# EAGLE design Otoponic (EAGLE 9.6.2)
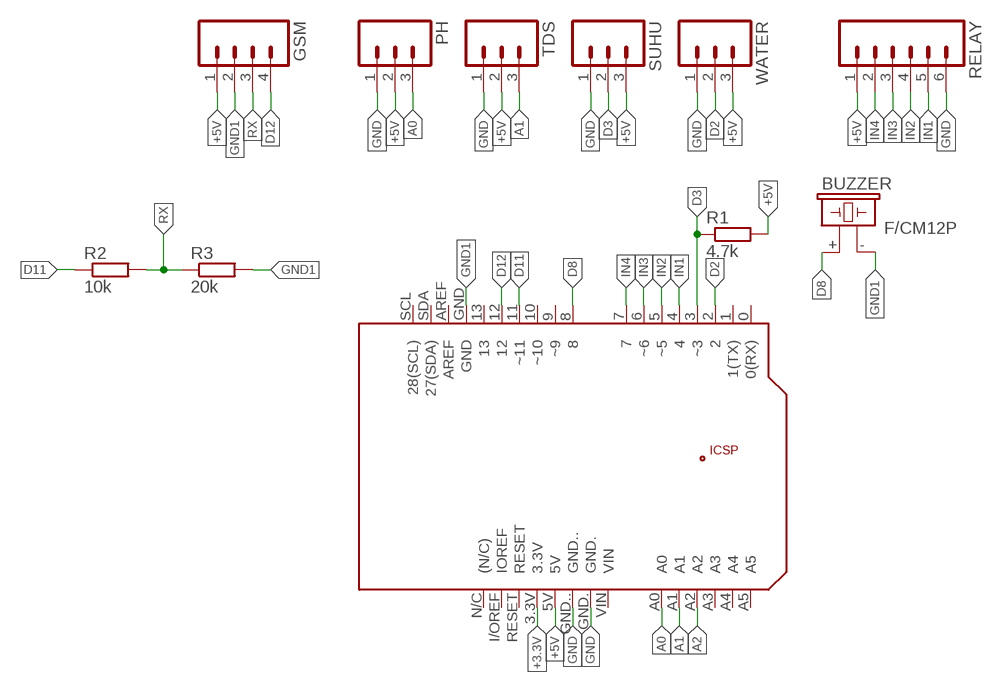
[diagram p0: schematic, sheet 1]

## Parts
BUZZER  F/CM12P  [F/CM12P]
GSM  M04  [04P]
PCB2  ARDUINO_UNO  [ARDUINO_UNO]
PH  M03  [03P]
R1  4.7k  R-EU_0207/10  [0207/10]
R2  10k  R-EU_0207/10  [0207/10]
R3  20k  R-EU_0207/10  [0207/10]
RELAY  M06  [06P]
SUHU  M03  [03P]
TDS  M03  [03P]
WATER  M03  [03P]

## Nets
+3.3V: PCB2.3.3V
+5V: GSM.1 PCB2.5V PH.2 R1.2 RELAY.1 SUHU.3 TDS.2 WATER.3
A0: PCB2.A0 PH.3
A1: PCB2.A1 TDS.3
A2: PCB2.A2
D2: PCB2.2 WATER.2
D3: PCB2.3(~3) R1.1 SUHU.2
D8: BUZZER.+ PCB2.8
D11: PCB2.11(~11) R2.1
D12: GSM.4 PCB2.12
GND: PCB2.GND. PCB2.GND.. PH.1 RELAY.6 SUHU.1 TDS.1 WATER.1
GND1: BUZZER.- GSM.2 PCB2.GND R3.2
IN1: PCB2.4 RELAY.5
IN2: PCB2.5(~5) RELAY.4
IN3: PCB2.6(~6) RELAY.3
IN4: PCB2.7 RELAY.2
RX: GSM.3 R2.2 R3.1
Unconnected: PCB2.0(0(RX)) PCB2.1(1(TX)) PCB2.9(~9) PCB2.10(~10) PCB2.13 PCB2.+5V PCB2.A3 PCB2.A4 PCB2.A5 PCB2.AREF PCB2.GND_ PCB2.I/OREF(IOREF) PCB2.MISO PCB2.MOSI PCB2.N/C((N/C)) PCB2.RESET PCB2.RESET. PCB2.SCK PCB2.SCL(28(SCL)) PCB2.SDA(27(SDA)) PCB2.VIN

## Library data of the parts
BUZZER = buzzerp:F/CM12P: BUZZER Source: Buerklin; OC_FARNELL: unknown; OC_NEWARK: unknown
GSM = con-amp-quick:M04: AMP QUICK CONNECTOR; OC_FARNELL: unknown; OC_NEWARK: unknown
PCB2 = E14_Arduino_revC:ARDUINO_UNO: Device for representing an Arduino Uno board with a footprint in an EAGLE design. Created by Dave Young for Element14. More EAGLE documentation at: http://www.element14.com/community/community/knode/cadsoft_eagle
PH SUHU TDS WATER = con-amp-quick:M03: AMP QUICK CONNECTOR; OC_FARNELL: unknown; OC_NEWARK: unknown
R1-R3 = rcl:R-EU_: RESISTOR, European symbol; SPICEPREFIX: R
RELAY = con-amp-quick:M06: AMP QUICK CONNECTOR; OC_FARNELL: unknown; OC_NEWARK: unknown

## Board
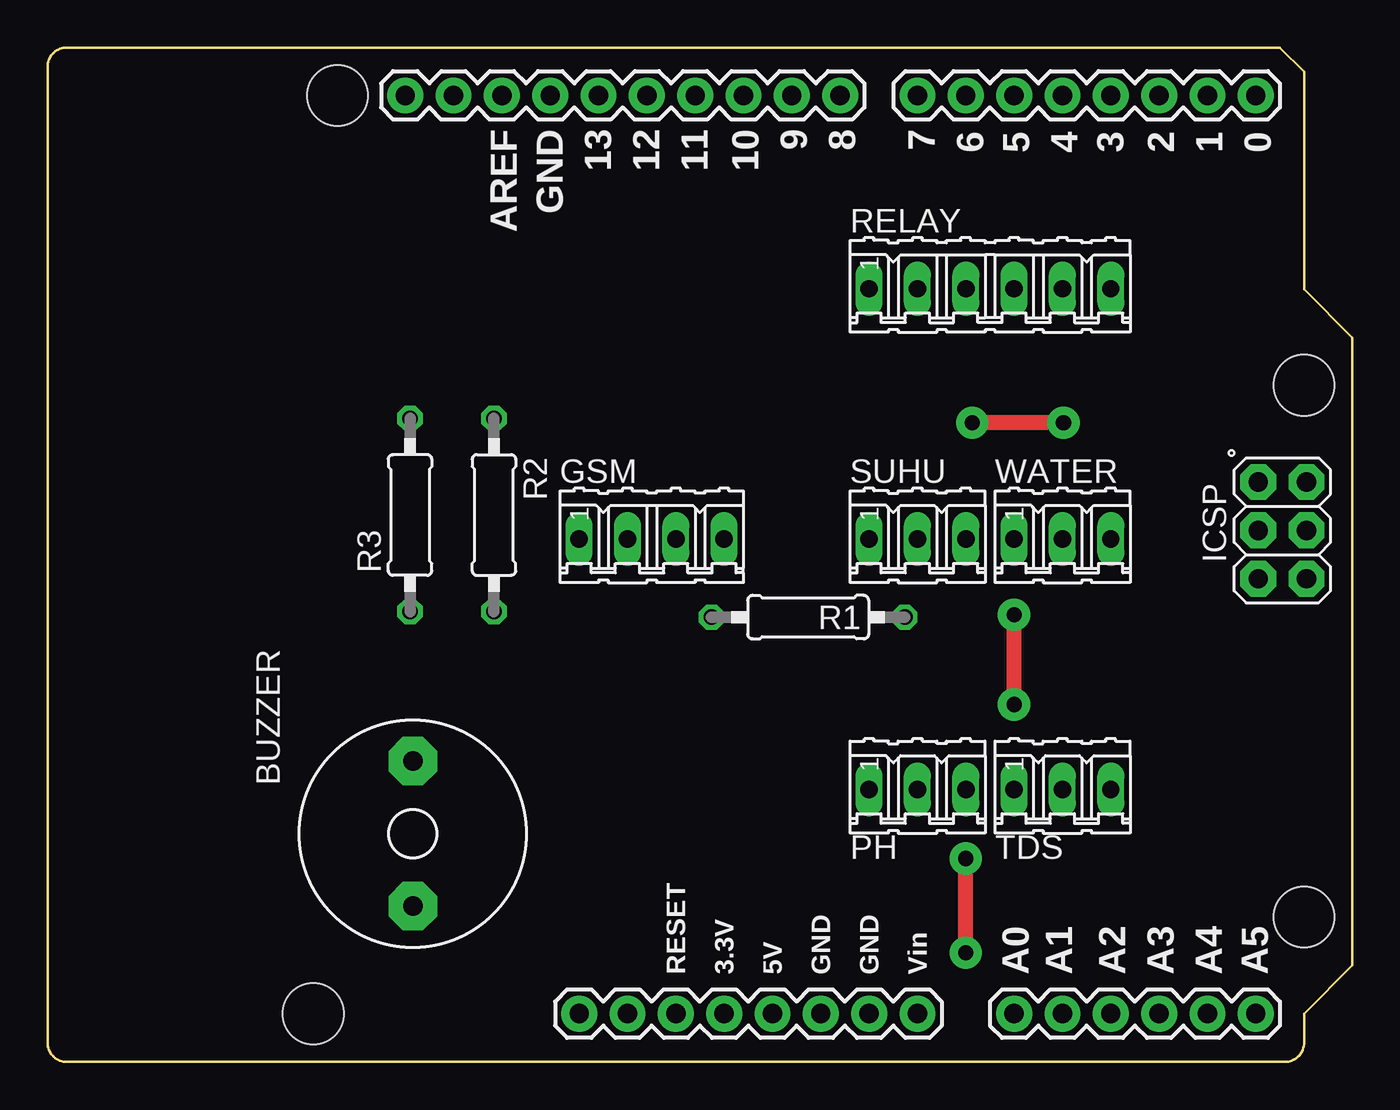
[diagram p1: board, top side]
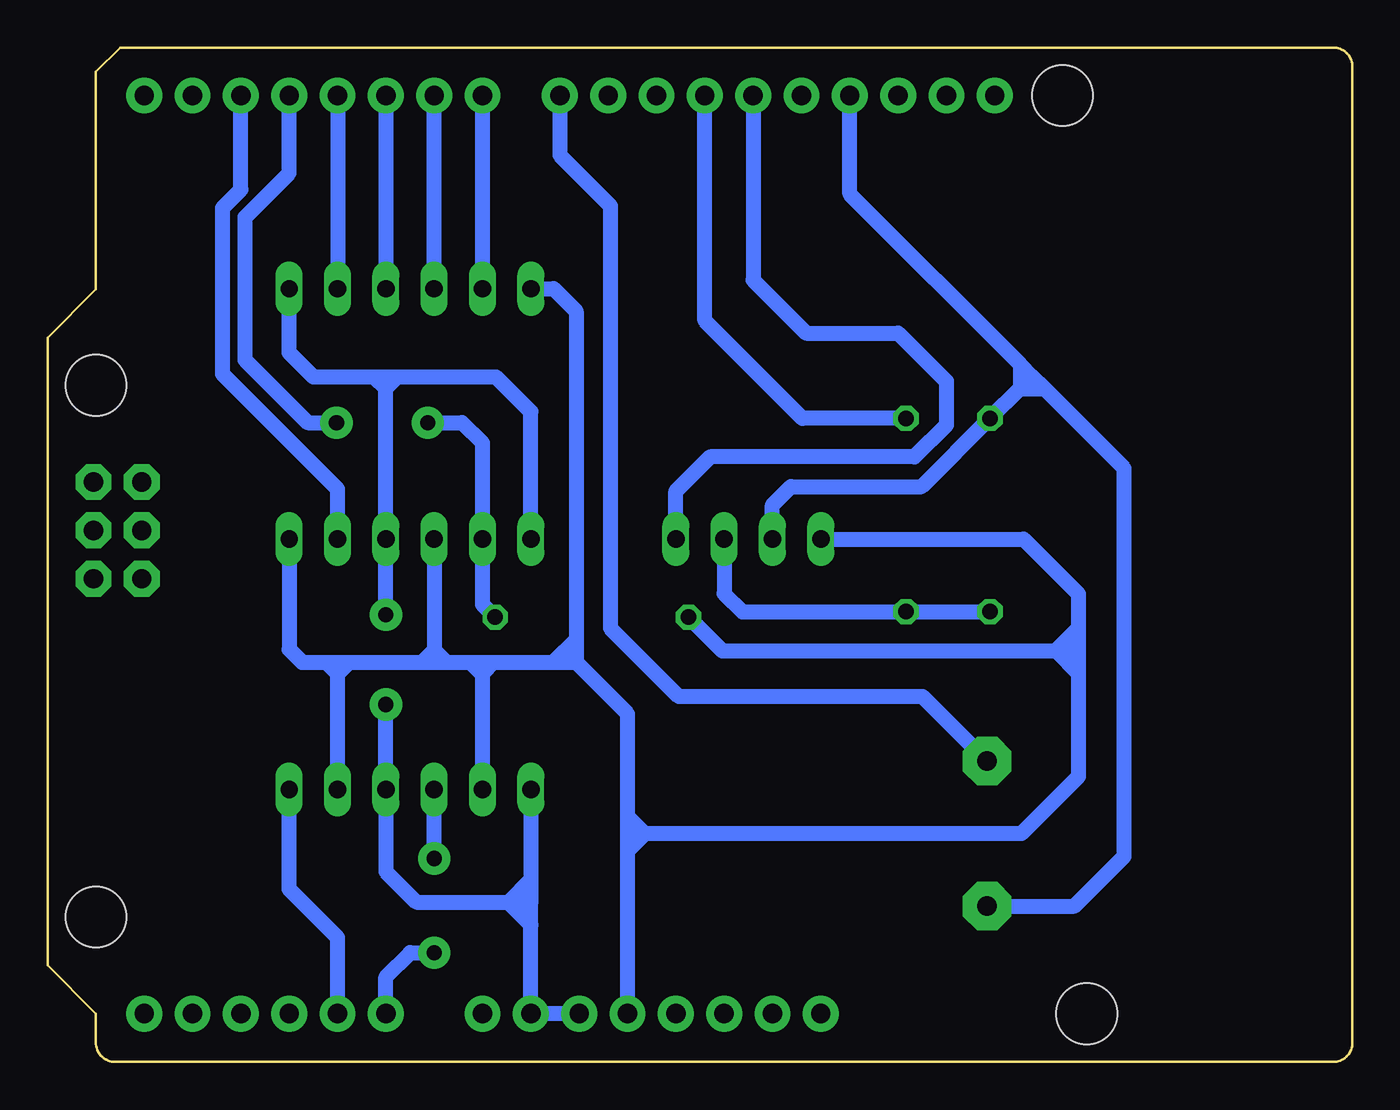
[diagram p2: board, bottom side, seen from below]

Size 68.58 x 53.31 mm. Coordinates in mm from the lower left corner, seen from the top.
Copper layers (1*16): Top 0.035mm / dielectric 1.5mm / Bottom 0.035mm
Design rules "default": minimum track width 0.8mm, minimum drill 0.8mm, track to track 15mil, track to pad 15mil, pad to pad 15mil, via to via 15mil, smd to smd 6mil, copper to edge 40mil, drill to drill 6mil, minimum pad ring 10mil, minimum via ring 8mil, stop-mask expansion 4mil, vias tented up to drill 0mil, thermal gap 10mil

### Footprints (pad centres in the part's own frame; a part is rotated, then mirrored left to right if it is on the bottom)
F/CM12P = drill 1.016 pad 2.54 octagon: + 3.81,0; - -3.81,0
04P = drill 0.914 long: 1 -3.81,0; 2 -1.27,0; 3 1.27,0; 4 3.81,0
ARDUINO_UNO = drill 1.016 pad 1.88: 0 63.5,50.8; 1 60.96,50.8; 2 58.42,50.8; 3 55.88,50.8; 3.3V 35.56,2.54; 4 53.34,50.8; 5 50.8,50.8; 5V 38.1,2.54; 6 48.26,50.8; 7 45.72,50.8; 8 41.656,50.8; 9 39.116,50.8; 10 36.576,50.8; 11 34.036,50.8; 12 31.496,50.8; 13 28.956,50.8; A0 50.8,2.54; A1 53.34,2.54; A2 55.88,2.54; A3 58.42,2.54; A4 60.96,2.54; A5 63.5,2.54; AREF 23.876,50.8; GND 26.416,50.8; GND. 43.18,2.54; GND.. 40.64,2.54; I/OREF 30.48,2.54; N/C 27.94,2.54; RESET 33.02,2.54; SCL 18.796,50.8; SDA 21.336,50.8; VIN 45.72,2.54 | drill 1.016 pad 1.88 octagon: +5V 66.167,30.48; GND_ 66.167,25.4; MISO 63.627,30.48; MOSI 66.167,27.94; RESET. 63.627,25.4; SCK 63.627,27.94 | hole 3.2: 66.04,7.62; 66.04,35.56; 15.24,50.8; 13.97,2.54
03P = drill 0.914 long: 1 -2.54,0; 2 0,0; 3 2.54,0
0207/10 = drill 0.813 octagon: 1 -5.08,0; 2 5.08,0
06P = drill 0.914 long: 1 -6.35,0; 2 -3.81,0; 3 -1.27,0; 4 1.27,0; 5 3.81,0; 6 6.35,0

### Placement (x,y rotation side)
BUZZER  19.2,12 90 top
GSM  31.75,27.48 0 top
PCB2  0,0 0 top
PH  45.72,14.32 0 top
R1  39.97,23.38 180 top
R2  23.46,28.75 270 top
R3  19.05,28.75 90 top
RELAY  49.53,40.64 0 top
SUHU  45.72,27.48 0 top
TDS  53.34,14.32 0 top
WATER  53.34,27.48 0 top

### Tracks (layer width: path | path; a pad name or v marks a point on that pad's centre or on a via)
+5V
  Bottom 0.8: RELAY.1 41.98,40.64 40.8,39.46 40.8,22.2 | 40.8,22.2 40.8,21 | GSM.1 17.28,27.48 14.4,24.6 14.4,22.8 | 14.4,22.8 14.4,21.6 | R1.2 33.12,21.6 15.6,21.6 | 14.4,21.6 15.6,21.6 | 14.4,21.6 14.4,20.4 | 14.4,20.4 14.4,15 17.4,12 37.2,12 | 15.6,21.6 14.4,20.4 | 15.6,21.6 14.4,22.8 | PCB2.5V 38.1,11.1 | 38.1,11.1 38.1,12 | 38.1,12 37.2,12 | WATER.3 55.88,21.68 55.2,21 53.94,21 | 53.94,21 53.4,21 | 53.4,21 52.8,21 | 52.8,21 48.9,21 | 48.9,21 48,21 | 48,21 47.62,21 | 47.62,21 46.35,21 | 46.35,21 45.6,21 | 45.6,21 45.12,21 | 45.12,21 42,21 | 42,21 40.8,21 | SUHU.3 48.26,21.6 | 48.26,21.6 48.26,21.26 48,21 | TDS.2 53.34,20.4 | 53.34,20.4 53.34,20.94 53.4,21 | PH.2 45.72,20.4 | 45.72,20.4 45.72,20.88 45.6,21 | 53.34,20.4 53.94,21 | 53.34,20.4 52.8,20.94 52.8,21 | 48.26,21.6 48.3,21.6 48.9,21 | 48.26,21.6 48.23,21.6 47.62,21 | 45.72,20.4 45.12,21 | 45.72,20.4 45.76,20.4 46.35,21 | 40.8,21 38.1,18.3 38.1,12.9 | 38.1,12 38.1,12.9 | 40.8,22.2 42,21 | 38.1,12.9 37.2,12 | 37.2,12 38.1,11.1
A0  (via drill 0.8 pad 1.7)
  Top 0.8: v48.26,5.74 v48.26,10.69
  Bottom 0.8: PCB2.A0 50.8,4.47 49.53,5.74 v48.26,5.74 | v48.26,10.69 PH.3
A1
  Bottom 0.8: PCB2.A1 53.34,6.54 55.88,9.08 TDS.3
D2
  Bottom 0.8: WATER.2 53.34,30.11 59.38,36.15 59.38,44.89 58.42,45.85 PCB2.2
D3  (via drill 0.8 pad 1.7)
  Top 0.8: v53.4,33.6 v48.6,33.6
  Bottom 0.8: PCB2.3 55.88,46.72 58.2,44.4 58.2,36.89 54.91,33.6 v53.4,33.6 | R1.1 45.72,24.04 SUHU.2 45.72,32.52 46.8,33.6 v48.6,33.6
D8
  Bottom 0.8: PCB2.8 41.66,47.66 39,45 39,22.8 35.4,19.2 22.59,19.2 BUZZER.+
D11
  Bottom 0.8: R2.1 28.9,33.83 34.04,38.96 PCB2.11
D12
  Bottom 0.8: GSM.4 35.56,30 33.76,31.8 23.02,31.8 21.35,33.47 21.35,35.78 23.87,38.31 28.71,38.31 31.5,41.1 PCB2.12
GND  (via drill 0.8 pad 1.7)
  Top 0.8: v50.8,18.79 v50.8,23.51
  Bottom 0.8: PCB2.GND.. PCB2.GND. 43.18,7.2 | 43.18,7.2 43.18,8.4 | PH.1 43.18,9.6 | 43.18,9.6 43.18,8.4 | SUHU.1 43.18,34.18 45,36 50.4,36 | 50.4,36 51,36 | 51,36 51.4,36 | 51.4,36 54.6,36 55.88,37.28 RELAY.6 | 44.38,8.4 49.2,8.4 50.8,10 TDS.1 v50.8,18.79 | 44.38,8.4 43.18,8.4 | 43.18,9.6 44.38,8.4 | 43.18,7.2 44.38,8.4 | v50.8,23.51 WATER.1 50.8,35.4 | 50.8,35.4 50.8,35.8 51,36 | 51.4,36 50.8,35.4 | 50.8,35.4 50.4,35.8 50.4,36
GND1
  Bottom 0.8: 16.82,36.02 17.44,36.64 | 17.44,36.64 26.42,45.62 PCB2.GND | 16.18,35.38 12,31.2 12,10.8 14.61,8.19 BUZZER.- | 16.18,35.38 16.82,36.02 | GSM.2 30.48,29.27 29.51,30.24 22.64,30.24 R3.2 17.44,35.44 | 17.44,35.44 16.86,36.02 16.82,36.02 | 17.44,35.44 17.44,36.64 | 17.44,35.44 17.38,35.38 16.18,35.38
IN1
  Bottom 0.8: PCB2.4 RELAY.5
IN2
  Bottom 0.8: PCB2.5 RELAY.4
IN3
  Bottom 0.8: RELAY.3 PCB2.6
IN4
  Bottom 0.8: RELAY.2 PCB2.7
RX
  Bottom 0.8: GSM.3 33.02,24.62 32.05,23.65 23.48,23.65 R2.2 R3.1